# EAGLE design SPARK (EAGLE 9.6.2)
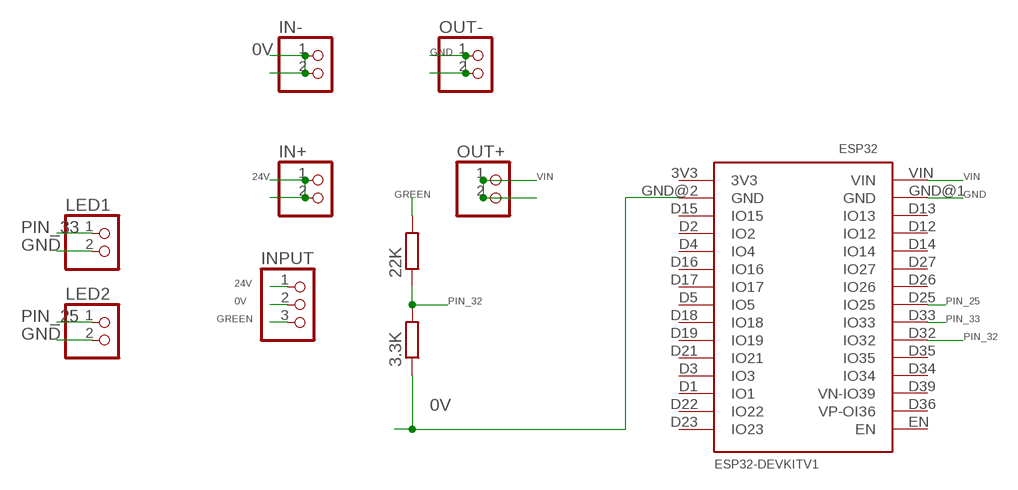
[diagram p0: schematic, sheet 1]

## Parts
3.3K  R-EU_0207/10  [0207/10]
22K  R-EU_0207/10  [0207/10]
ESP32  ESP32DEVKITV1  [ESP32-DEVKITV1]
IN+  PINHD-1X2  [1X02]
IN-  PINHD-1X2  [1X02]
INPUT  PINHD-1X3  [1X03]
LED1  PINHD-1X2  [1X02]
LED2  PINHD-1X2  [1X02]
OUT+  PINHD-1X2  [1X02]
OUT-  PINHD-1X2  [1X02]

## Nets
0V: 3.3K.1 ESP32.GND@2(GND) IN-.1 IN-.2 INPUT.2
24V: IN+.1 IN+.2 INPUT.1
GND: ESP32.GND@1(GND) LED1.2 LED2.2 OUT-.1 OUT-.2
GREEN: 22K.2 INPUT.3
PIN_25: ESP32.D25(IO25) LED2.1
PIN_32: 3.3K.2 22K.1 ESP32.D32(IO32)
PIN_33: ESP32.D33(IO33) LED1.1
VIN: ESP32.VIN OUT+.1 OUT+.2
Unconnected: ESP32.3V3 ESP32.D1(IO1) ESP32.D2(IO2) ESP32.D3(IO3) ESP32.D4(IO4) ESP32.D5(IO5) ESP32.D12(IO12) ESP32.D13(IO13) ESP32.D14(IO14) ESP32.D15(IO15) ESP32.D16(IO16) ESP32.D17(IO17) ESP32.D18(IO18) ESP32.D19(IO19) ESP32.D21(IO21) ESP32.D22(IO22) ESP32.D23(IO23) ESP32.D26(IO26) ESP32.D27(IO27) ESP32.D34(IO34) ESP32.D35(IO35) ESP32.D36(VP-OI36) ESP32.D39(VN-IO39) ESP32.EN

## Library data of the parts
3.3K 22K = resistor:R-EU_: RESISTOR, European symbol
ESP32 = ESP32-DEVKITV1:ESP32DEVKITV1
IN+ IN- LED1 LED2 OUT+ OUT- = pinhead:PINHD-1X2: PIN HEADER
INPUT = pinhead:PINHD-1X3: PIN HEADER

## Board
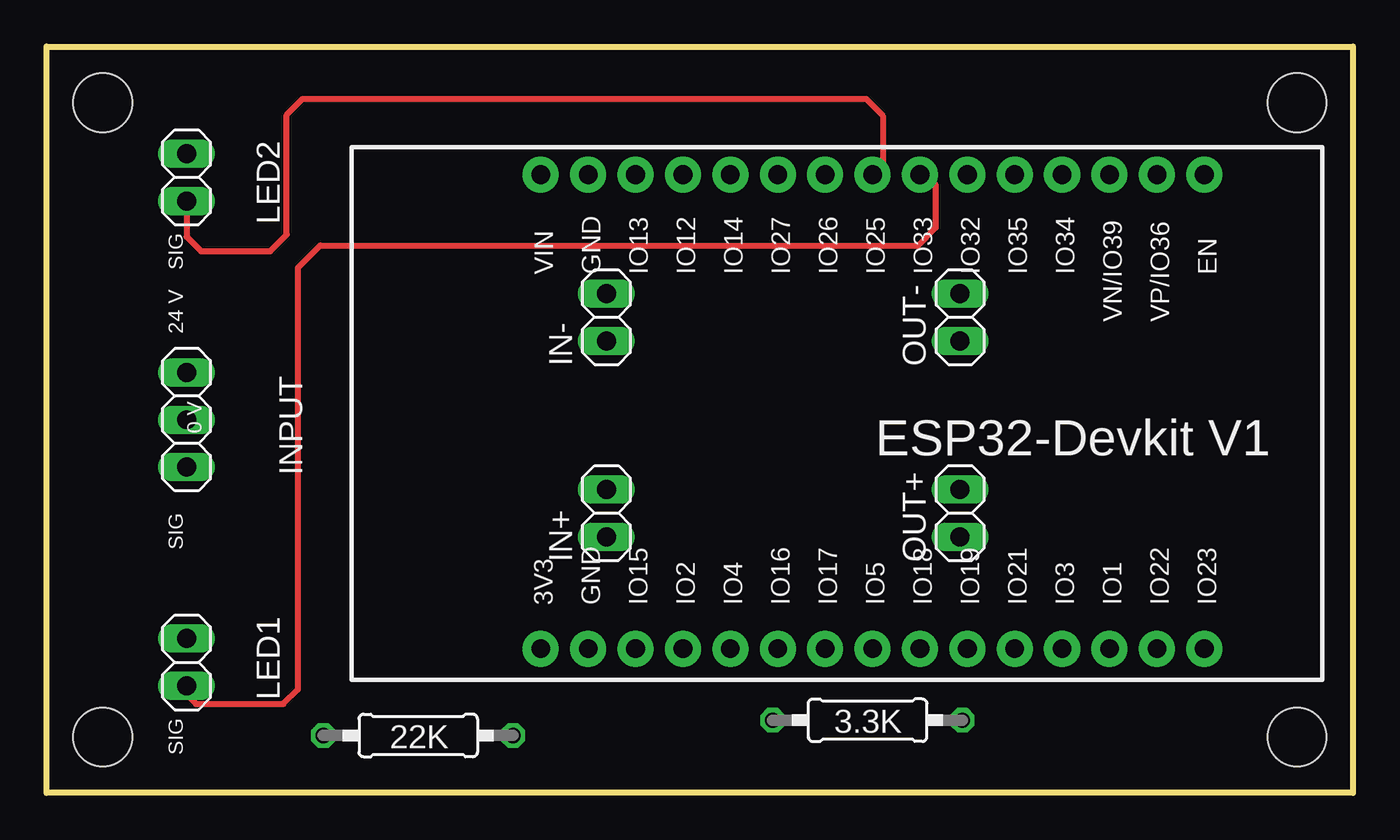
[diagram p1: board, top side]
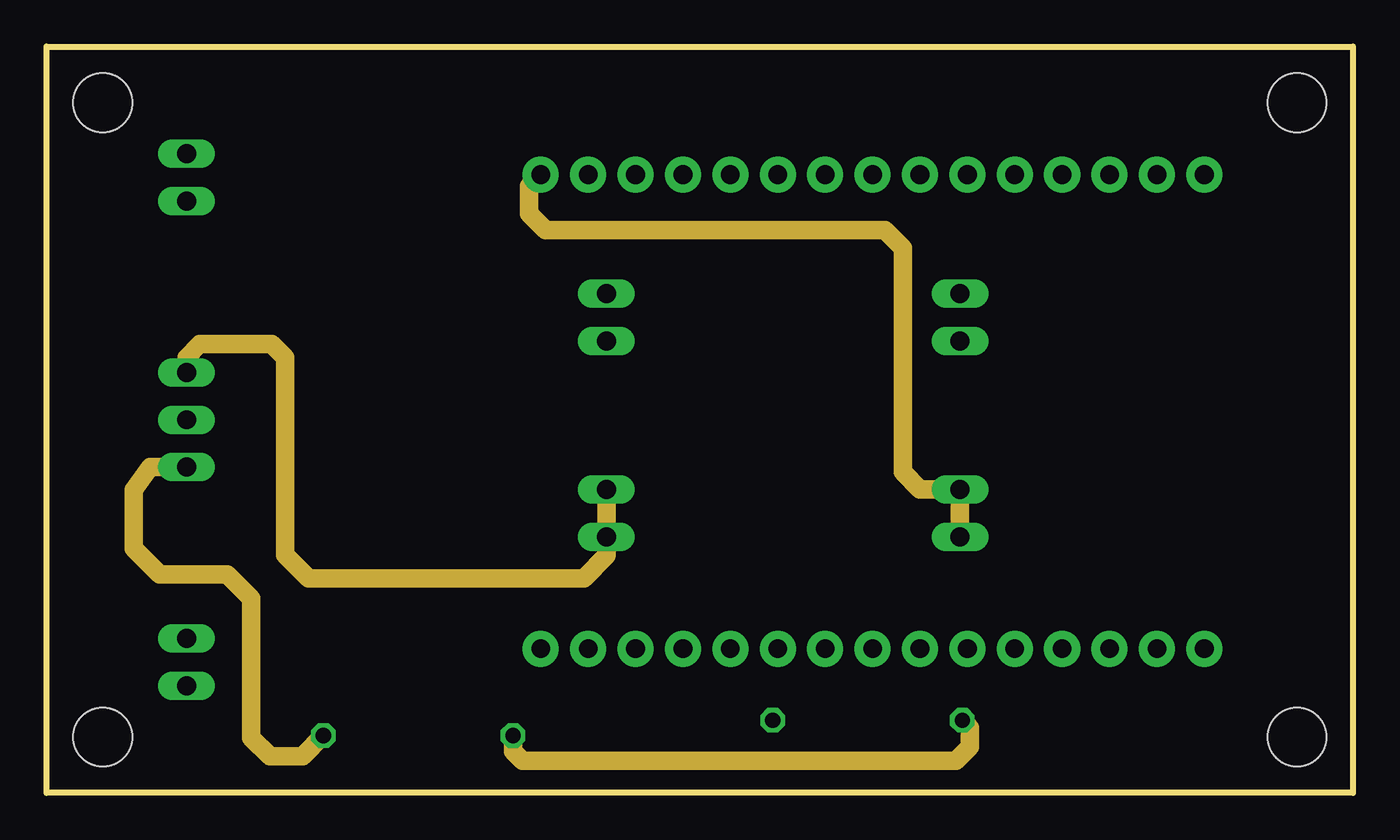
[diagram p2: board, inner layer Route2]
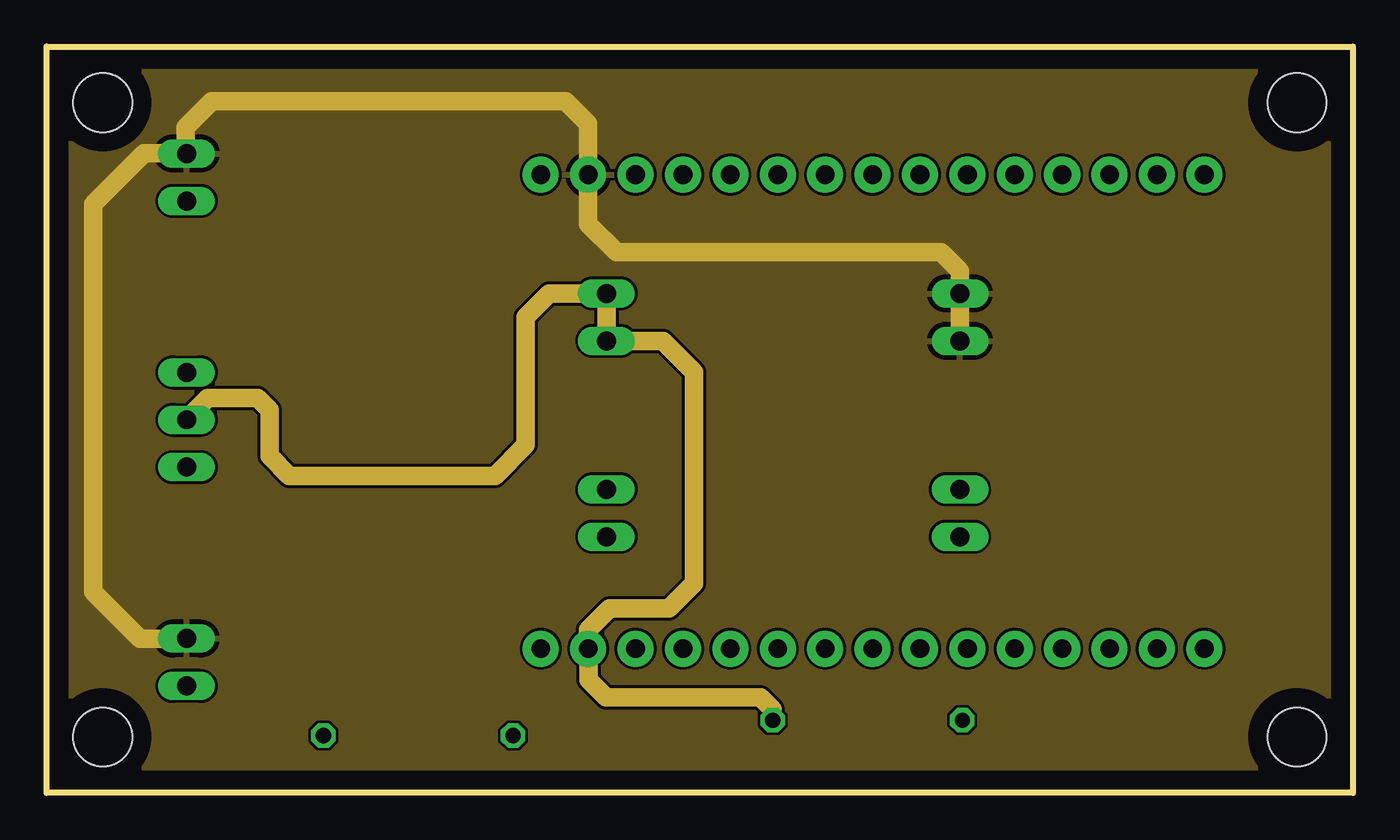
[diagram p3: board, inner layer Route15]
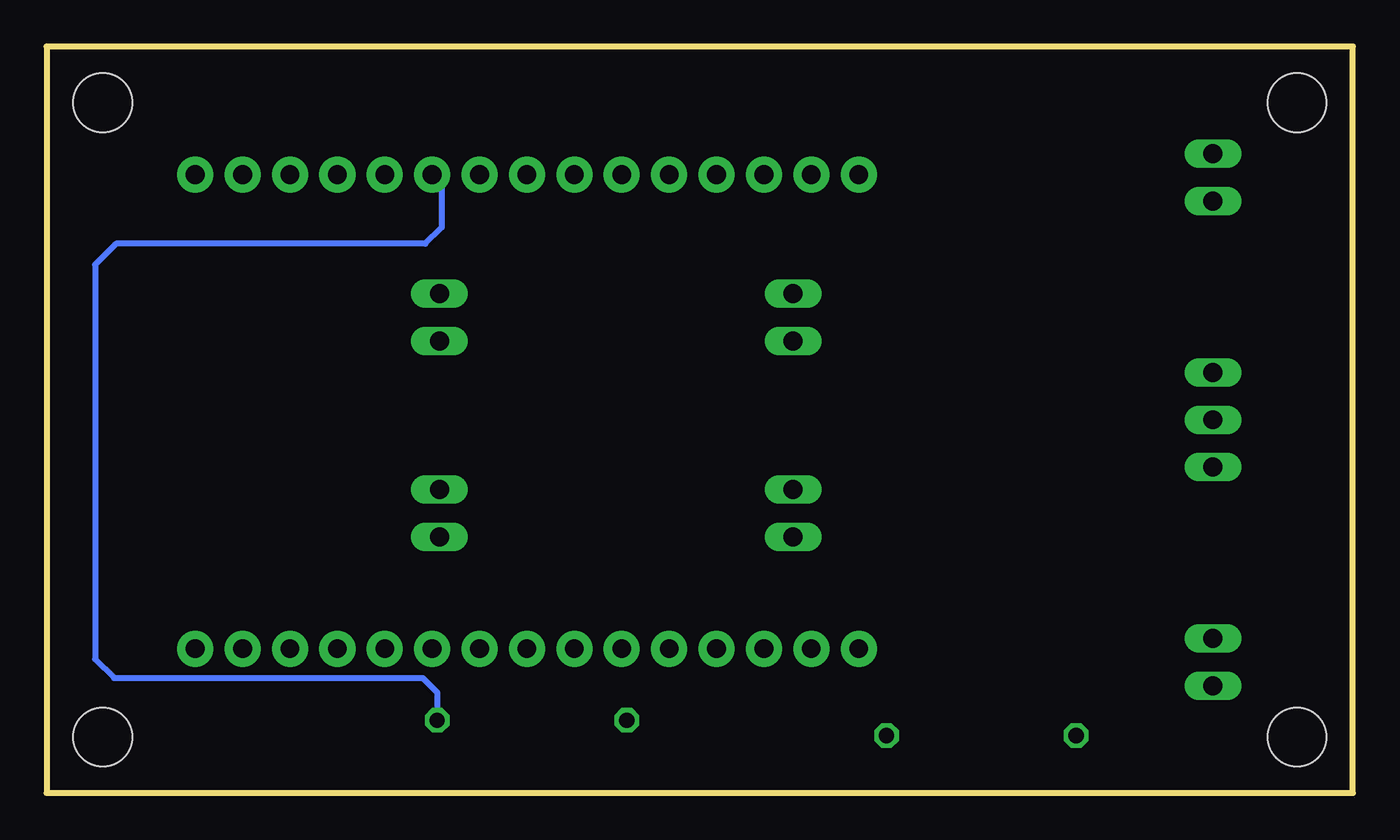
[diagram p4: board, bottom side, seen from below]

Size 70 x 40 mm. Coordinates in mm from the lower left corner, seen from the top.
Outline: 0,0 0,40 70,40 70,0 0,0
Copper layers (1+2*15+16): Top 0.035mm / dielectric 1.5mm / Route2 0.035mm / dielectric 0.15mm / Route15 0.035mm / dielectric 0.2mm / Bottom 0.035mm
Design rules "default *": minimum track width 6mil, minimum drill 0.35mm, track to track 6mil, track to pad 6mil, pad to pad 6mil, via to via 6mil, smd to smd 6mil, copper to edge 40mil, drill to drill 6mil, minimum pad ring 10mil, minimum via ring 8mil, stop-mask expansion 4mil, vias tented up to drill 0mil, thermal gap 10mil
Holes 3.15 mm at 3,3 67,3 67,37 3,37

### Footprints (pad centres in the part's own frame; a part is rotated, then mirrored left to right if it is on the bottom)
0207/10 = drill 0.813 octagon: 1 -5.08,0; 2 5.08,0
ESP32-DEVKITV1 = drill 1 pad 1.93: 3V3 -16.52,-12.27; D1 13.96,-12.27; D2 -8.9,-12.27; D3 11.42,-12.27; D4 -6.36,-12.27; D5 1.26,-12.27; D12 -8.9,13.135; D13 -11.44,13.135; D14 -6.36,13.135; D15 -11.44,-12.27; D16 -3.82,-12.27; D17 -1.28,-12.27; D18 3.8,-12.27; D19 6.34,-12.27; D21 8.88,-12.27; D22 16.5,-12.27; D23 19.04,-12.27; D25 1.26,13.135; D26 -1.28,13.135; D27 -3.82,13.135; D32 6.34,13.135; D33 3.8,13.135; D34 11.42,13.135; D35 8.88,13.135; D36 16.5,13.135; D39 13.96,13.135; EN 19.04,13.135; GND@1 -13.98,13.135; GND@2 -13.98,-12.27; VIN -16.52,13.135
1X02 = drill 1.016 long: 1 -1.27,0; 2 1.27,0
1X03 = drill 1.016 long: 1 -2.54,0; 2 0,0; 3 2.54,0

### Placement (x,y rotation side)
3.3K  43.99,3.89 0 top
22K  19.91,3.08 180 top
ESP32  43,20 0 top
IN+  30,15 90 top
IN-  30,25.5 90 top
INPUT  7.5,20 270 top
LED1  7.5,7 90 top
LED2  7.5,33 90 top
OUT+  48.95,15 90 top
OUT-  48.95,25.5 90 top

### Tracks (layer width: path | path; a pad name or v marks a point on that pad's centre or on a via)
0V
  Route15 1: INPUT.2 7.5,20.05 8.62,21.17 11.31,21.17 11.94,20.53 11.94,18.06 13.01,17 24.02,17 25.66,18.64 25.66,25.51 26.92,26.77 IN-.2 IN-.1 33.02,24.23 34.7,22.55 34.7,11.23 33.37,9.9 30.17,9.9 29.02,8.75 ESP32.GND@2 29.04,7.71 29.04,6.04 29.97,5.12 38.26,5.12 38.91,4.47 3.3K.1
24V
  Route2 1: INPUT.1 7.5,23.35 8.21,24.05 12.06,24.05 12.79,23.33 12.79,12.76 14.04,11.51 28.79,11.51 30,12.72 IN+.1 IN+.2
GND
  Route15 1: OUT-.1 OUT-.2 48.95,27.96 47.93,28.98 30.53,28.98 29.02,30.49 ESP32.GND@1 29.02,35.86 27.8,37.08 8.83,37.08 7.44,35.69 7.44,34.33 LED2.2 5.23,34.28 2.5,31.55 2.5,10.77 5.03,8.24 7.47,8.24 LED1.2
  pour Route15: 0,0 0,40 70,40 70,0
GREEN
  Route2 1: INPUT.3 5.55,17.46 4.67,16.24 4.67,13.1 6.06,11.71 9.68,11.71 10.96,10.43 10.96,2.96 11.97,1.96 13.71,1.96 22K.2
PIN_25
  Top 0.314: LED2.1 7.5,29.81 8.28,29.04 11.98,29.04 12.87,29.93 12.87,36.35 13.72,37.2 43.91,37.2 44.81,36.3 44.81,33.69 ESP32.D25
PIN_32
  Route2 1: 22K.1 24.99,2.23 25.5,1.71 48.72,1.71 49.47,2.47 49.47,3.49 3.3K.2
  Bottom 0.314: ESP32.D32 48.83,32.63 48.83,30.31 49.71,29.44 66.28,29.44 67.4,28.31 67.4,7.17 66.39,6.15 49.84,6.15 49.07,5.38 3.3K.2
PIN_33
  Top 0.314: LED1.1 7.5,5.27 8.01,4.76 12.69,4.76 13.47,5.54 13.47,28.15 14.66,29.34 46.68,29.34 47.64,30.3 47.64,32.6 47.1,33.13 ESP32.D33
VIN
  Route2 1: OUT+.1 OUT+.2 46.8,16.27 45.88,17.19 45.88,29.21 44.94,30.16 26.74,30.16 25.86,31.04 25.86,32.51 ESP32.VIN

### Text on the board
tPlace: SIG | 24 V | 0 V | SIG | SIG